# Altium project 全兼容主控.PrjPCB
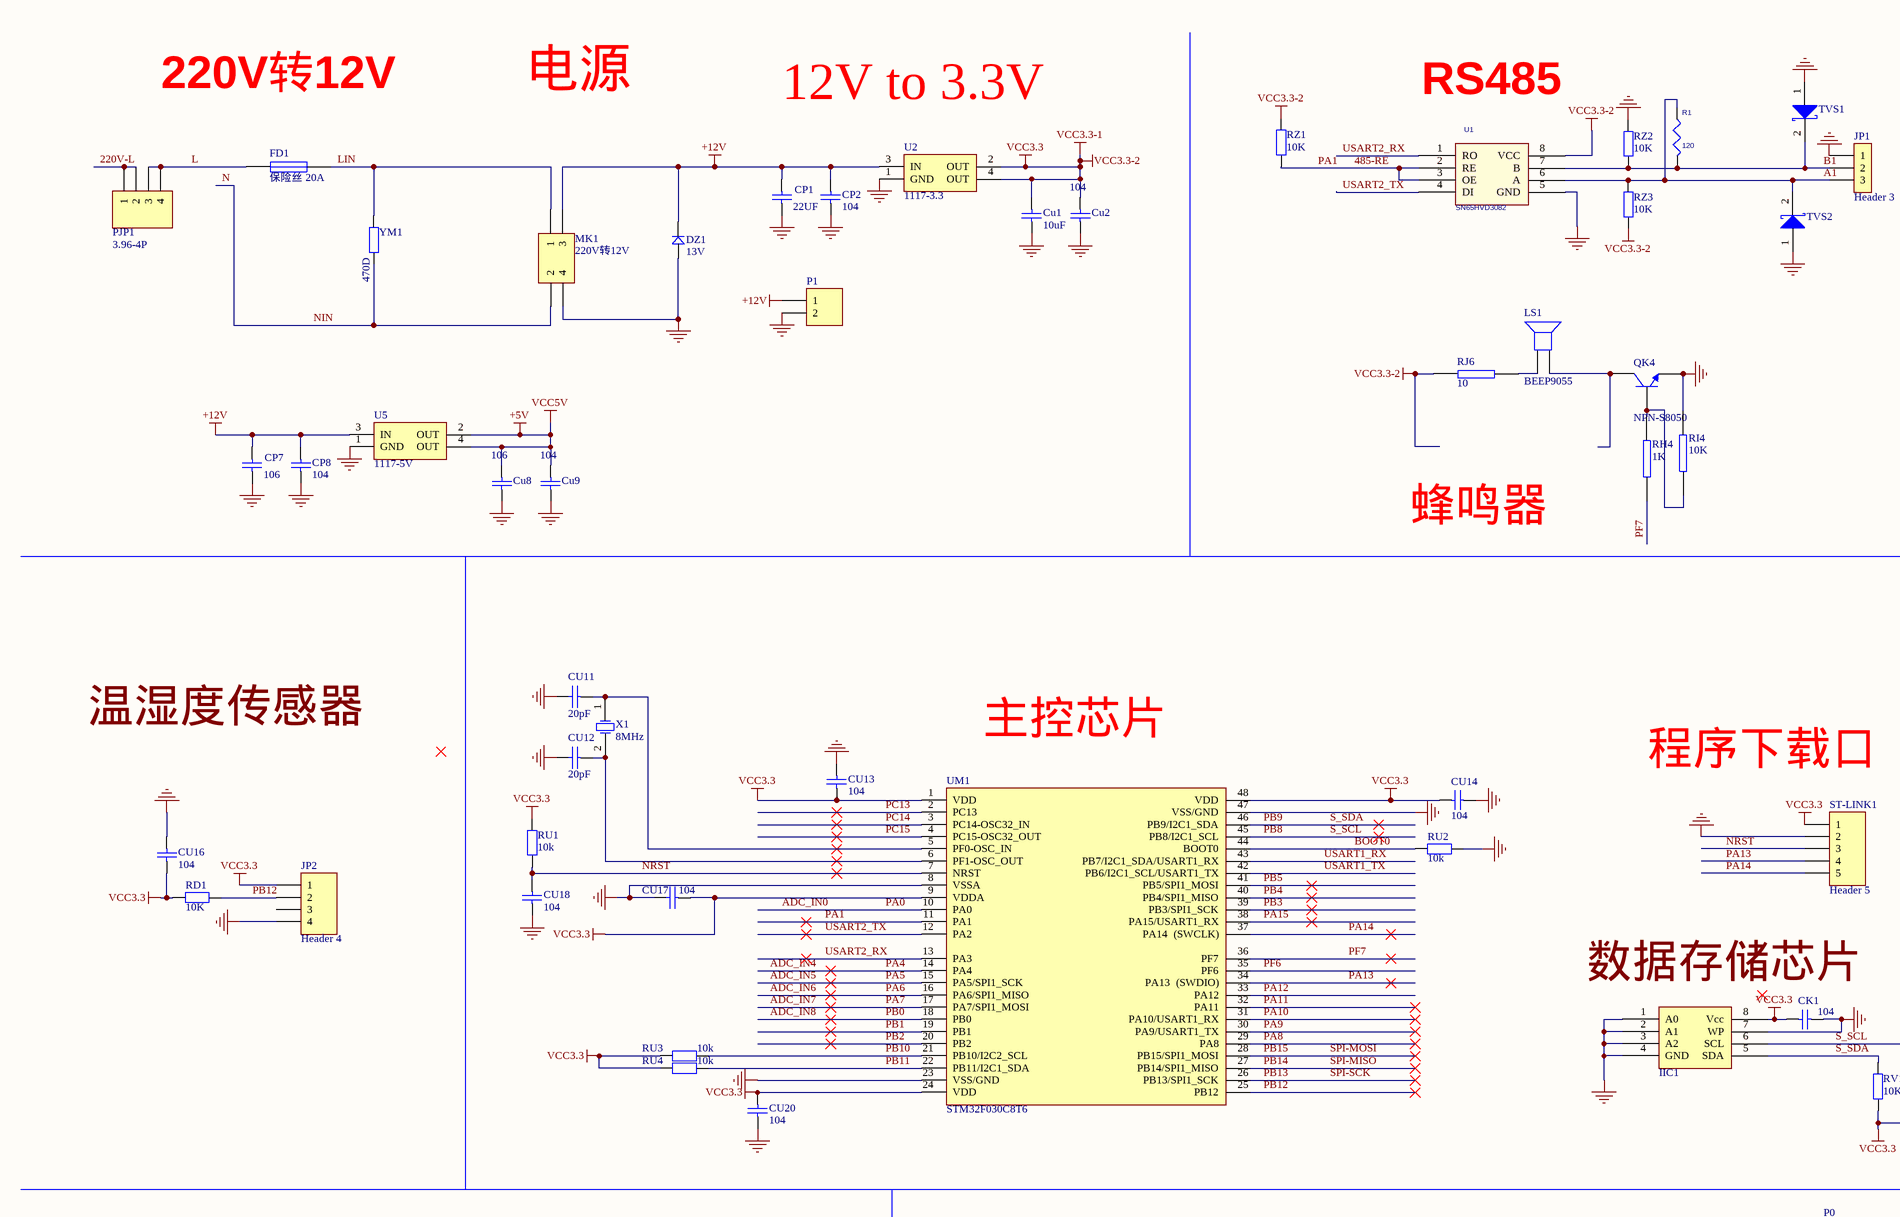
[diagram p0: 全兼容主控.SchDoc, top left]
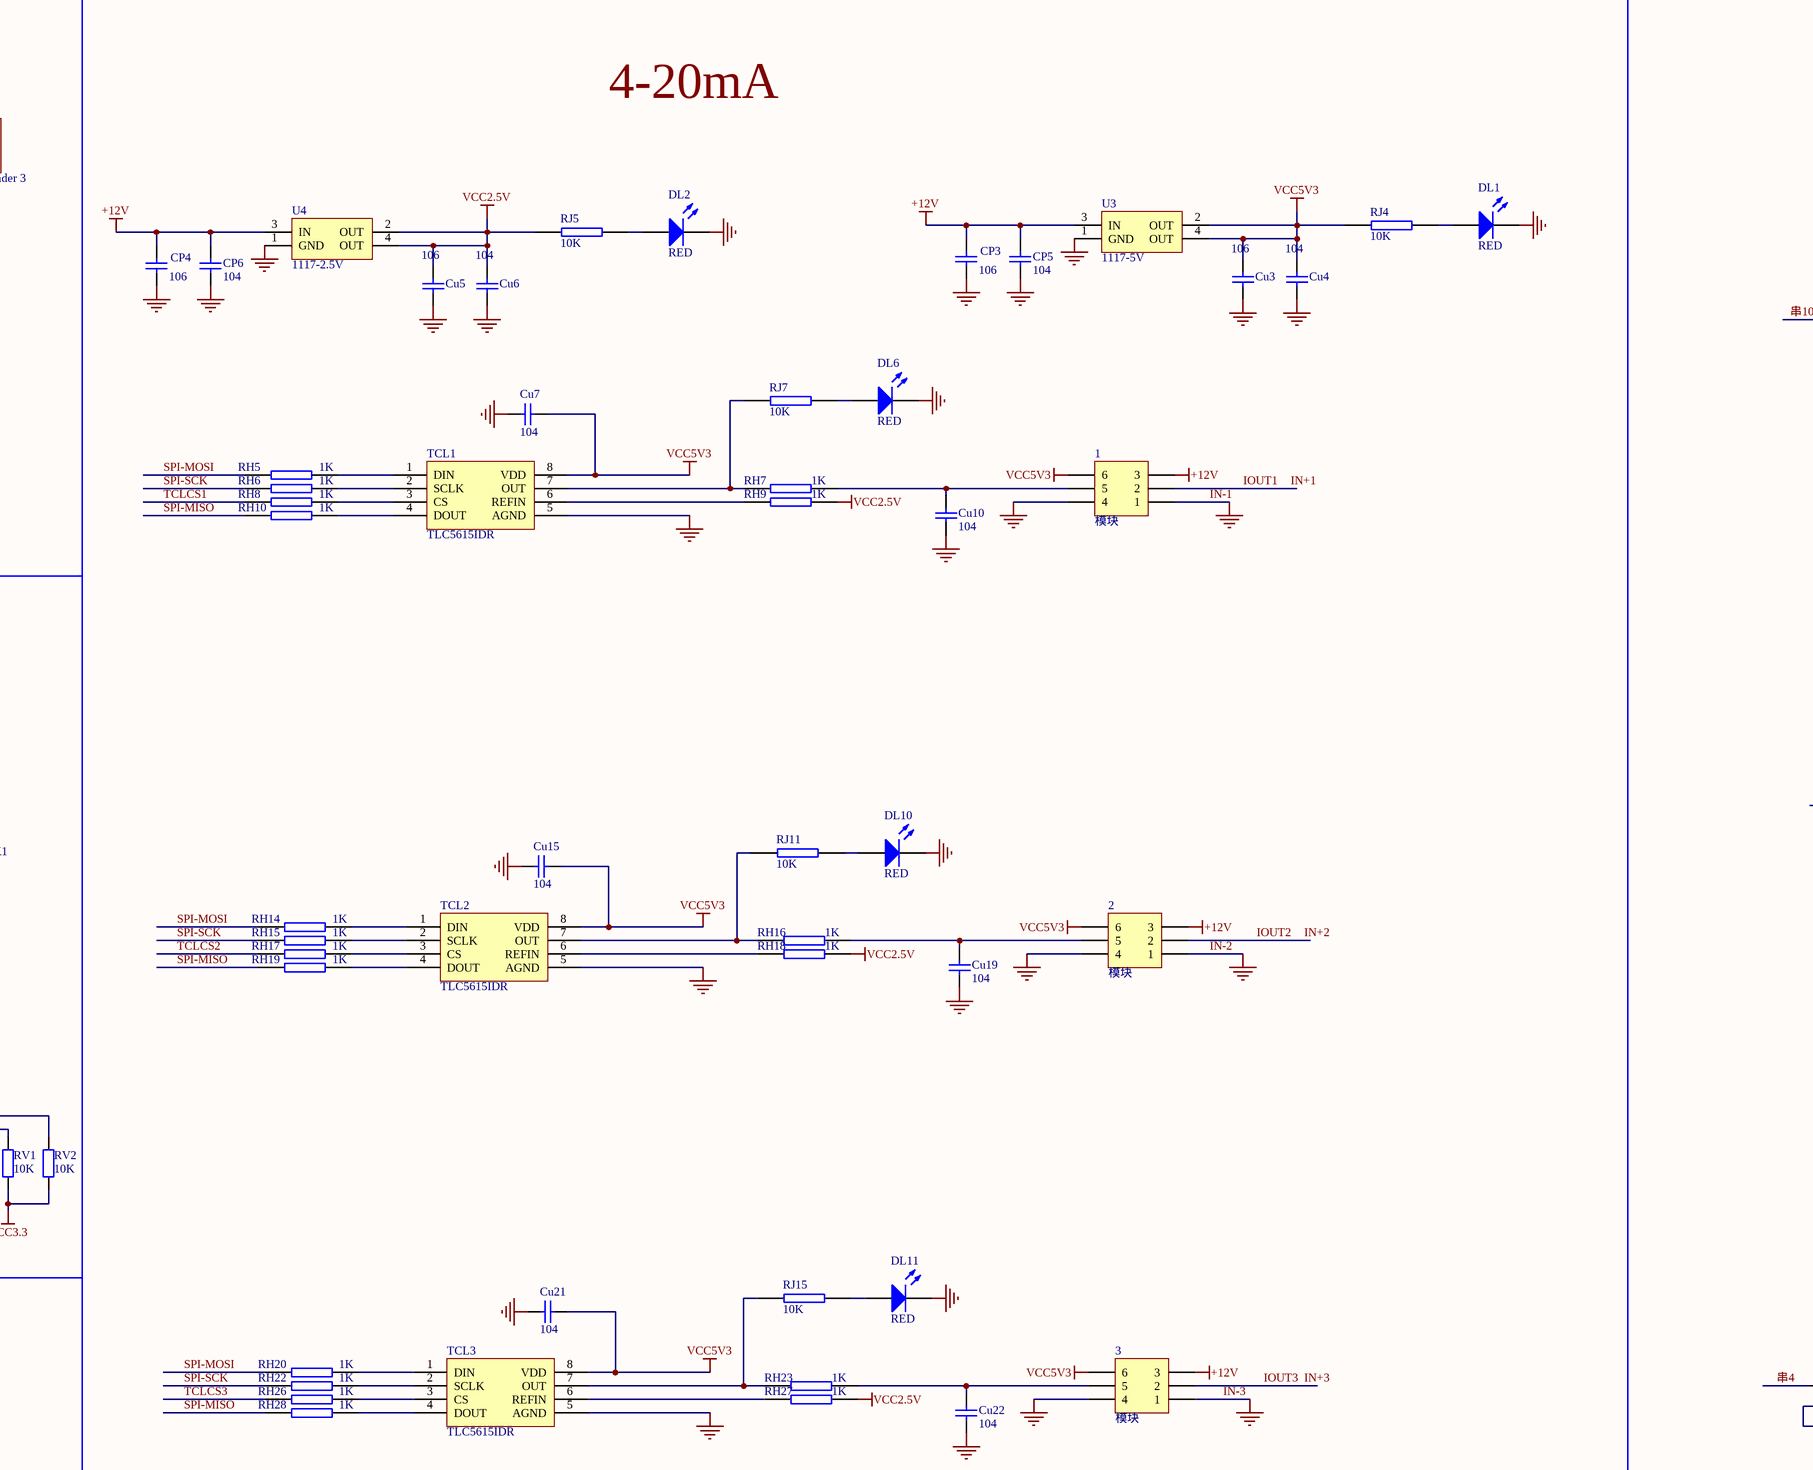
[diagram p1: 全兼容主控.SchDoc, top middle]
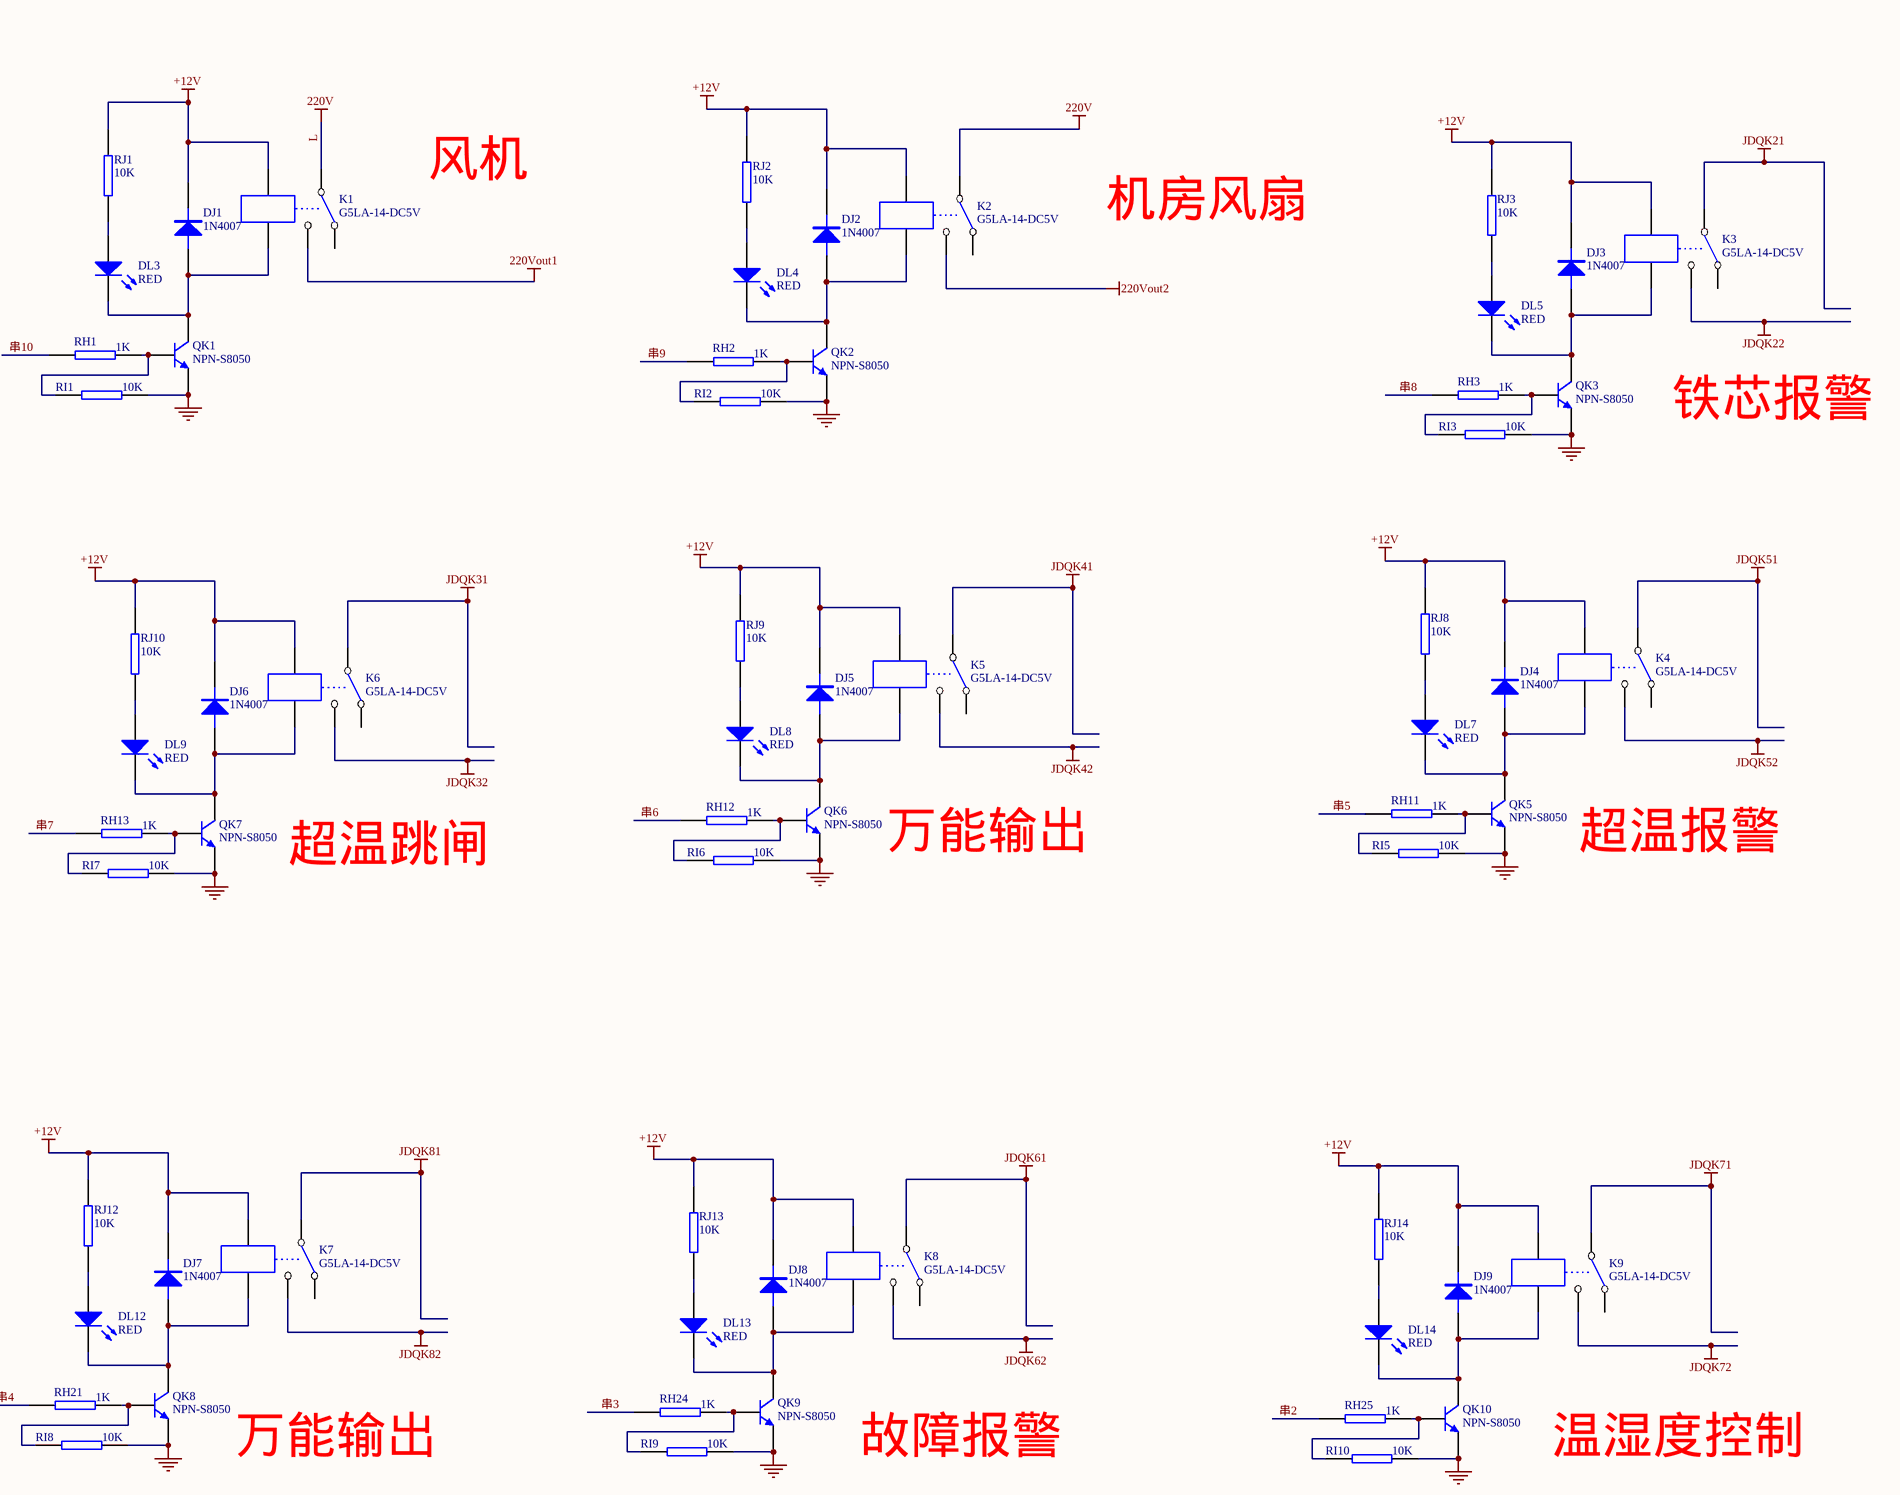
[diagram p2: 全兼容主控.SchDoc, top right]
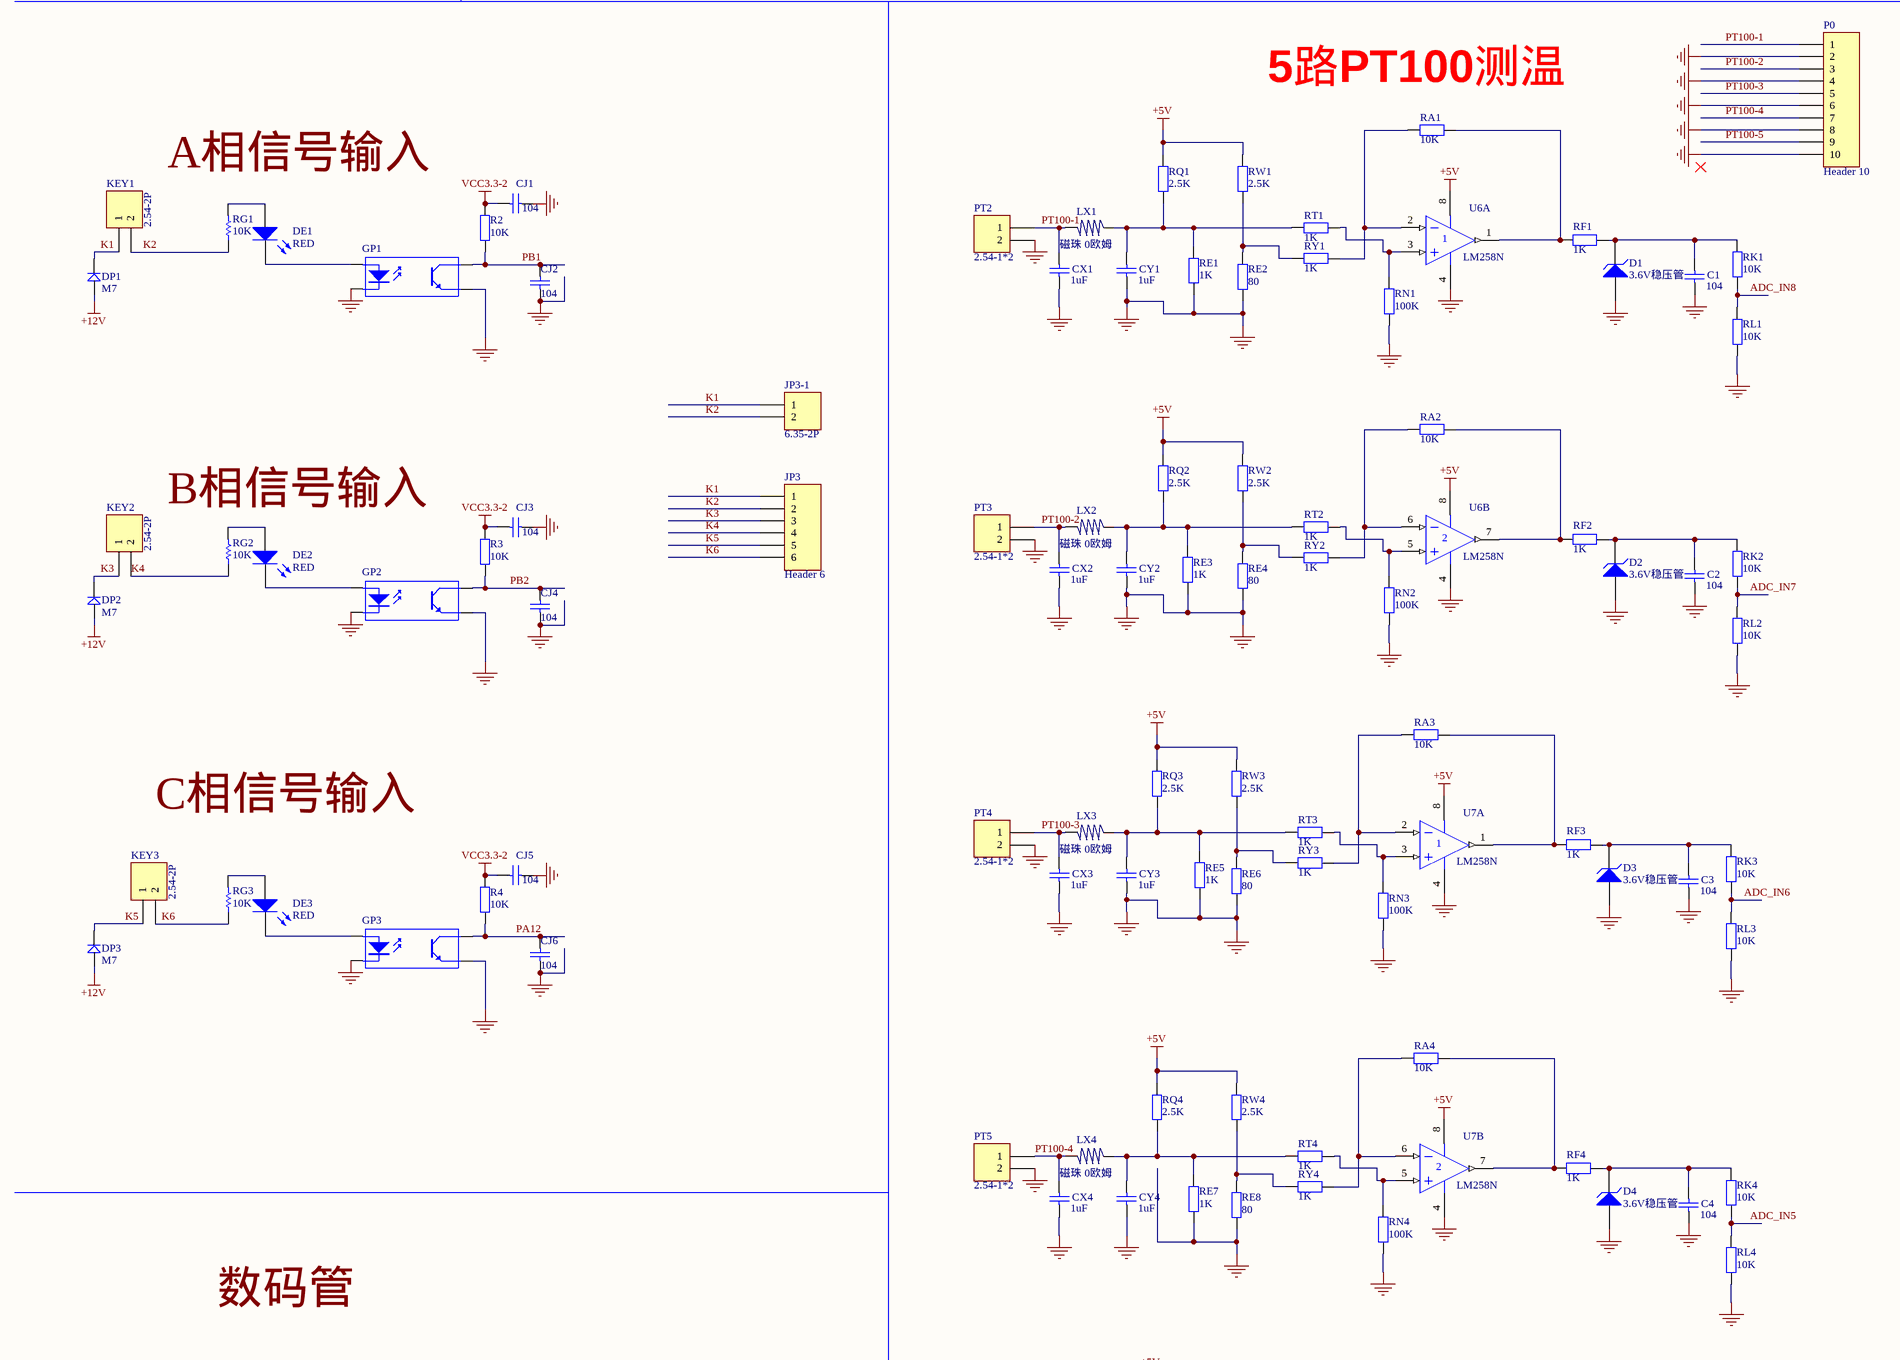
[diagram p3: 全兼容主控.SchDoc, centre left]
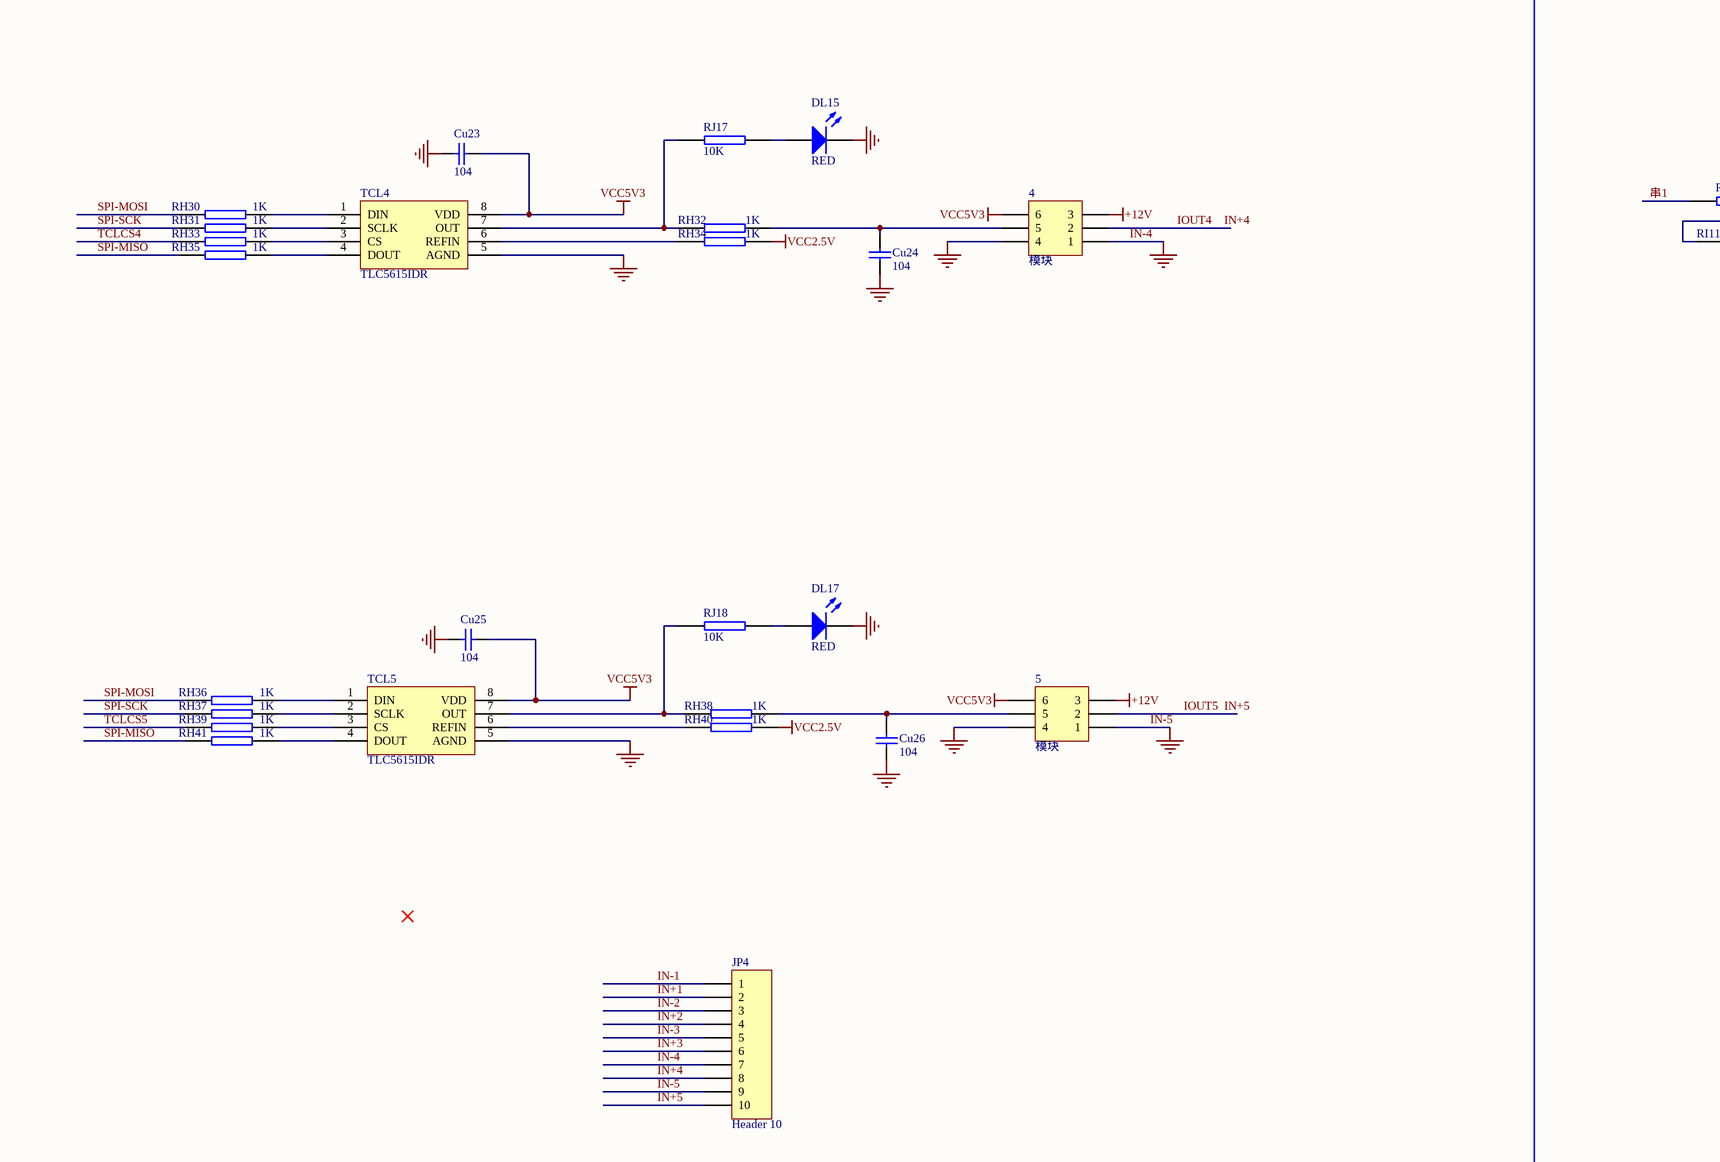
[diagram p4: 全兼容主控.SchDoc, centre middle]
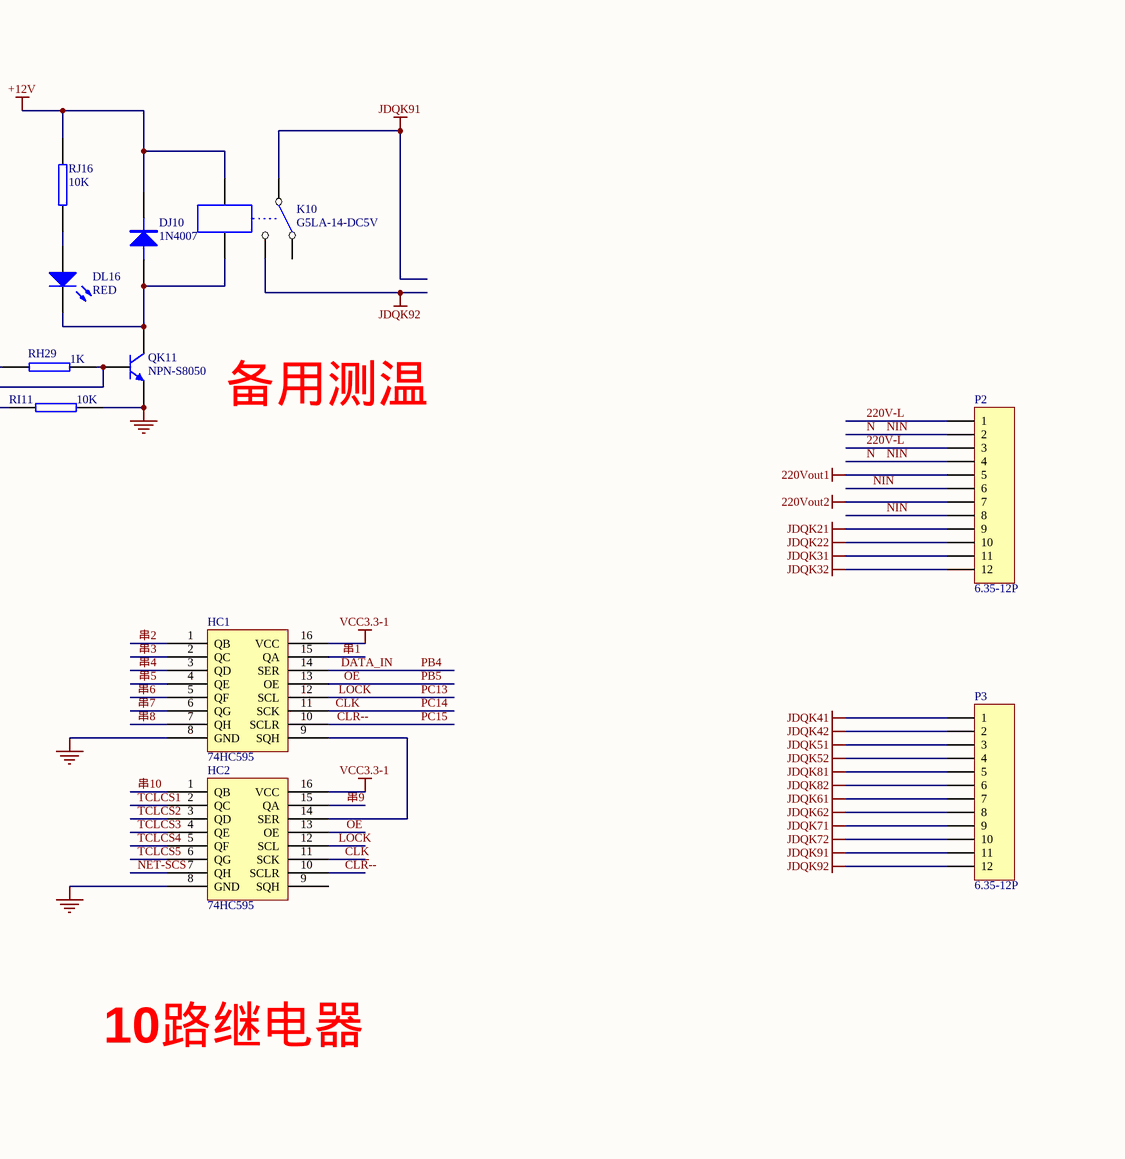
[diagram p5: 全兼容主控.SchDoc, centre right]
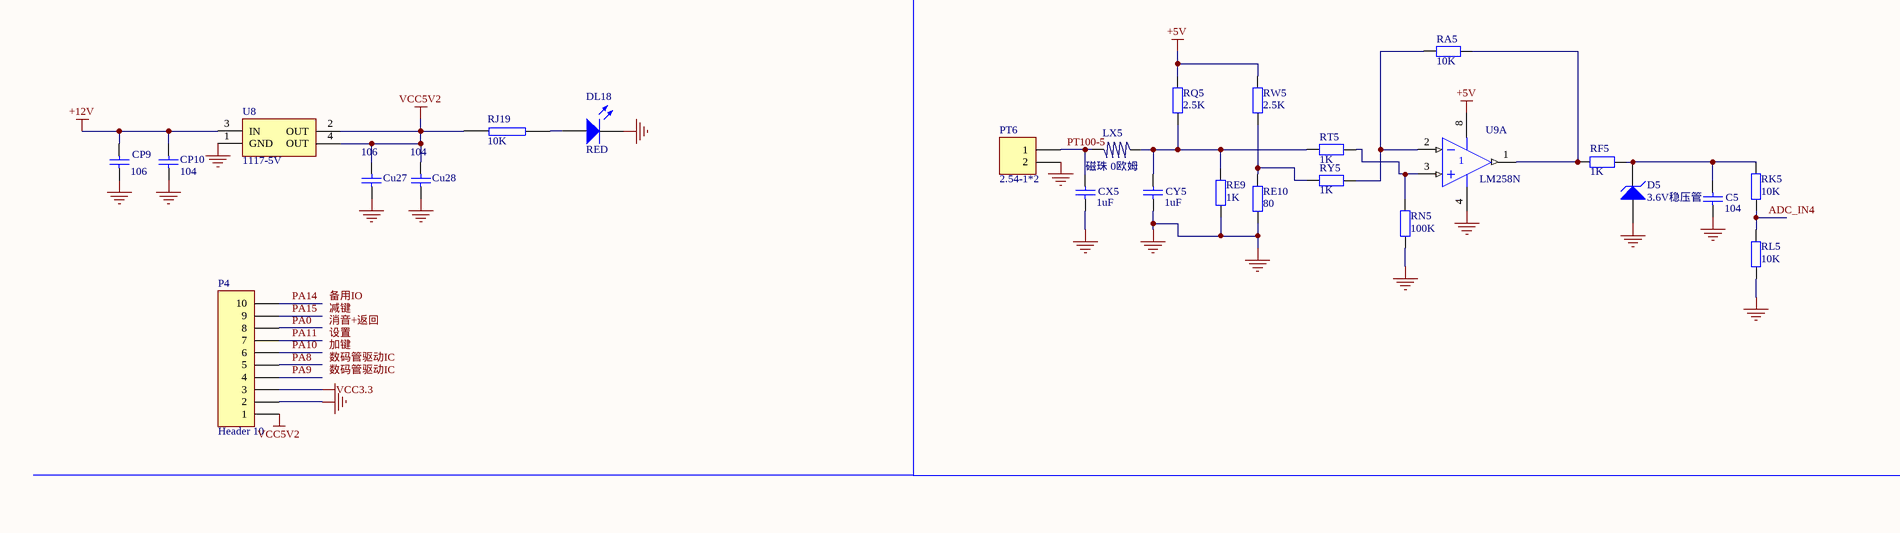
[diagram p6: 全兼容主控.SchDoc, bottom left]
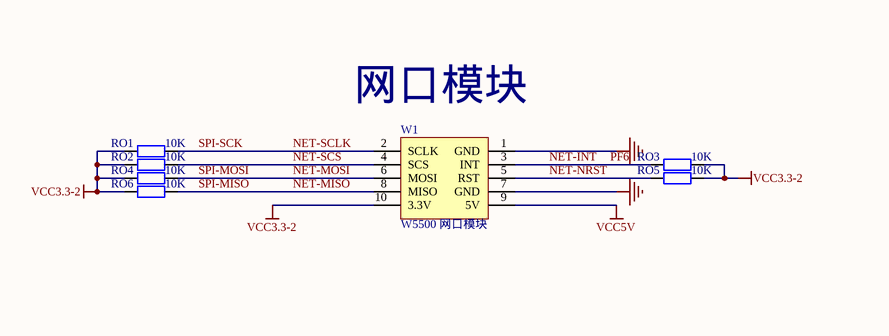
[diagram p7: 全兼容主控.SchDoc, bottom middle]
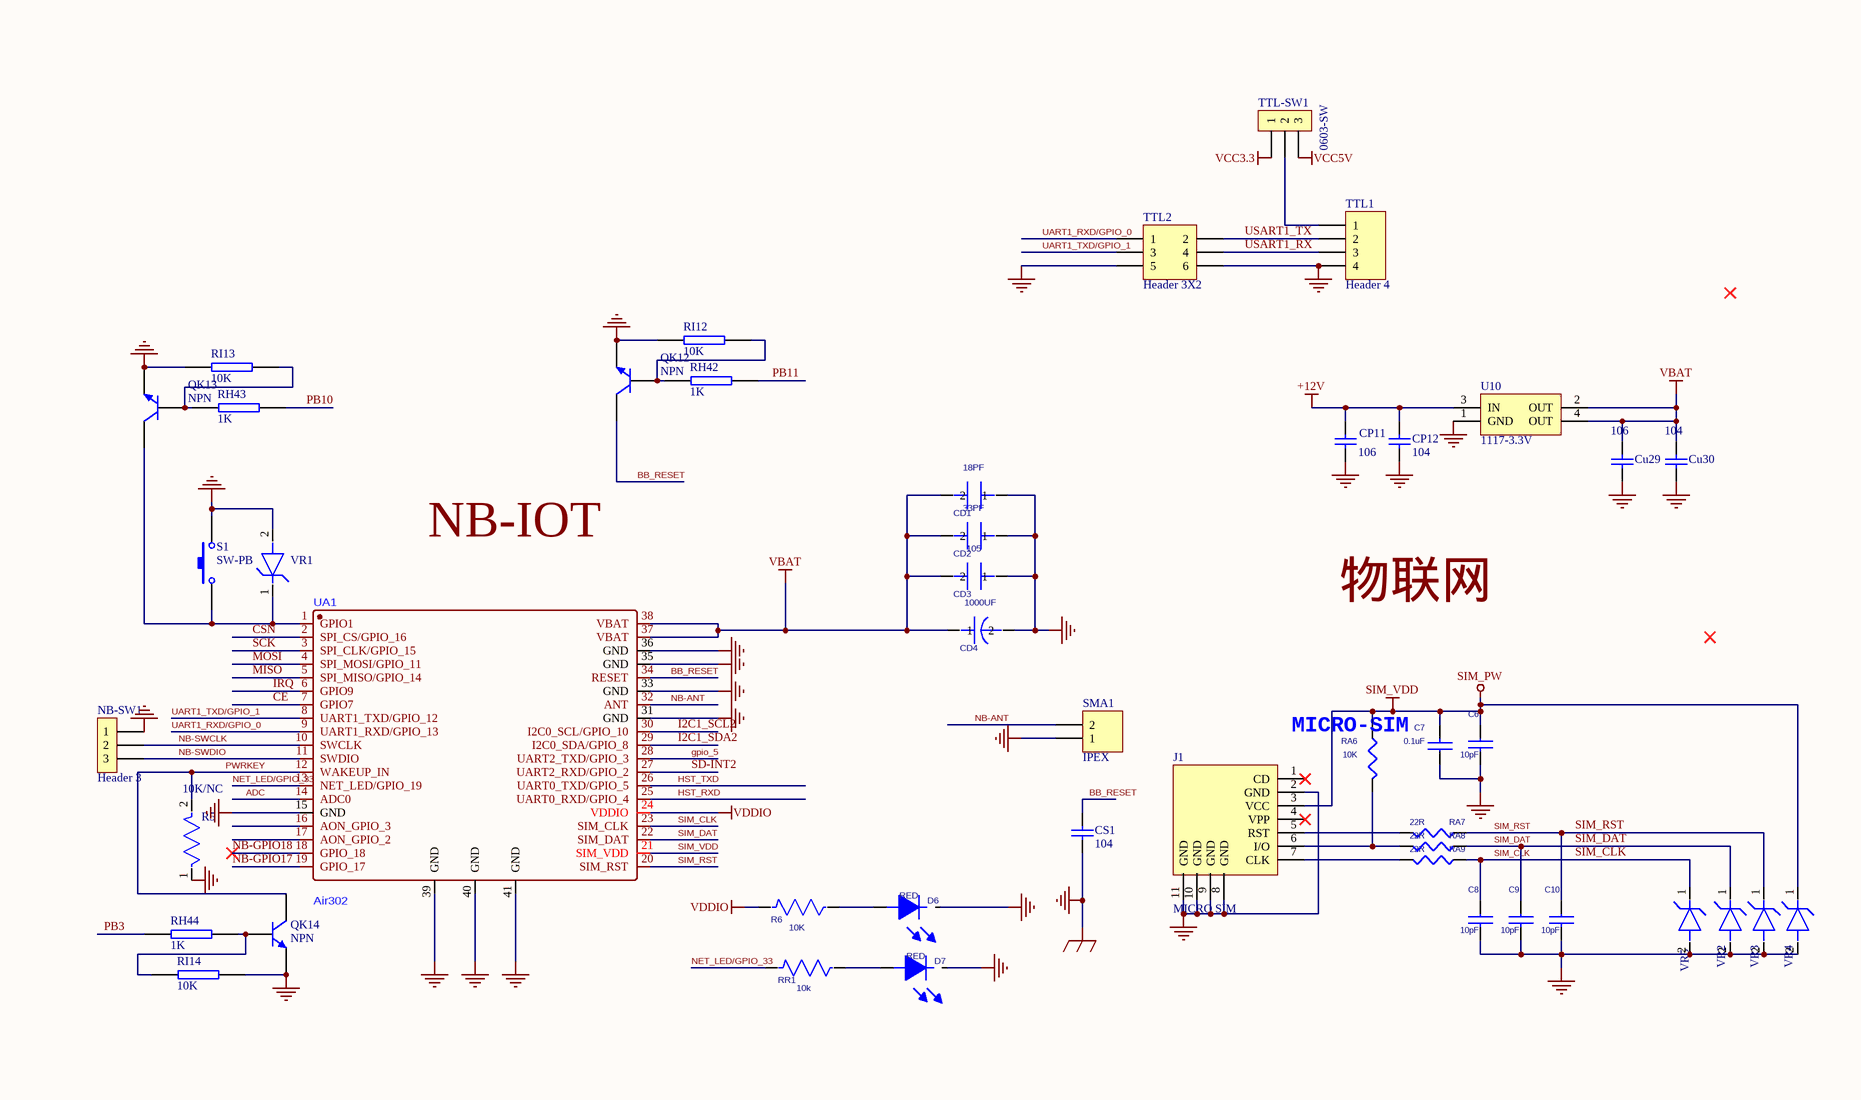
[diagram p8: 全兼容主控.SchDoc, bottom right]
1 sheet, 375 parts. Net scope: global (net labels, ports and power ports of the same name join across sheets).
Board file: 全兼容主控.PCBDOC

## Sheet 全兼容主控.SchDoc
size A0

### Parts
1  模块  [0-5V转4-20mA]
2  模块  [0-5V转4-20mA]
3  模块  [0-5V转4-20mA]
4  模块  [0-5V转4-20mA]
5  模块  [0-5V转4-20mA]
C1  104  [0603-1]
C2  104  [0603-1]
C3  104  [0603-1]
C4  104  [0603-1]
C5  104  [0603-1]
C6  10pF  [0603-1]
C7  0.1uF  [0603-1]
C8  10pF  [0603-1]
C9  10pF  [0603-1]
C10  10pF  [0603-1]
CD1  18PF  [0603-1]
CD2  33PF  [0603-1]
CD3  105  [0603-1]
CD4  1000UF  [贴片电容-1000UF-10.4X10.4]
CJ1  104  [0603-1]
CJ2  104  [0603-1]
CJ3  104  [0603-1]
CJ4  104  [0603-1]
CJ5  104  [0603-1]
CJ6  104  [0603-1]
CK1  104  [0603-1]
CP1  22UF  [0805]
CP2  104  [0603-1]
CP3  106  [0805]
CP4  106  [0805]
CP5  104  [0603-1]
CP6  104  [0603-1]
CP7  106  [0805]
CP8  104  [0603-1]
CP9  106  [0805]
CP10  104  [0603-1]
CP11  106  [0805]
CP12  104  [0603-1]
CS1  104  [0603-1]
Cu1  value 10uF  [0805]  (hidden comment: 106)
Cu2  104  [0603-1]
Cu3  106  [0805]
Cu4  104  [0603-1]
Cu5  106  [0805]
Cu6  104  [0603-1]
Cu7  104  [0603-1]
Cu8  106  [0805]
Cu9  104  [0603-1]
Cu10  104  [0603-1]
CU11  20pF  [0603-1]
CU12  20pF  [0603-1]
CU13  104  [0603-1]
CU14  104  [0603-1]
Cu15  104  [0603-1]
CU16  104  [0603-1]
CU17  104  [0603-1]
CU18  104  [0603-1]
Cu19  104  [0603-1]
CU20  104  [0603-1]
Cu21  104  [0603-1]
Cu22  104  [0603-1]
Cu23  104  [0603-1]
Cu24  104  [0603-1]
Cu25  104  [0603-1]
Cu26  104  [0603-1]
Cu27  106  [0805]
Cu28  104  [0603-1]
Cu29  106  [0805]
Cu30  104  [0603-1]
CX1  1uF  [1206]
CX2  1uF  [1206]
CX3  1uF  [1206]
CX4  1uF  [1206]
CX5  1uF  [1206]
CY1  1uF  [1206]
CY2  1uF  [1206]
CY3  1uF  [1206]
CY4  1uF  [1206]
CY5  1uF  [1206]
D1  3.6V稳压管  [DIODE]
D2  3.6V稳压管  [DIODE]
D3  3.6V稳压管  [DIODE]
D4  3.6V稳压管  [DIODE]
D5  3.6V稳压管  [DIODE]
D6  RED  [0603 - LED]
D7  RED  [0603 - LED]
DE1  RED  [0603 - LED]
DE2  RED  [0603 - LED]
DE3  RED  [0603 - LED]
DJ1  1N4007  [DIODE]
DJ2  1N4007  [DIODE]
DJ3  1N4007  [DIODE]
DJ4  1N4007  [DIODE]
DJ5  1N4007  [DIODE]
DJ6  1N4007  [DIODE]
DJ7  1N4007  [DIODE]
DJ8  1N4007  [DIODE]
DJ9  1N4007  [DIODE]
DJ10  1N4007  [DIODE]
DL1  RED  [0603 - LED]
DL2  RED  [0603 - LED]
DL3  RED  [0603 - LED]
DL4  RED  [0603 - LED]
DL5  RED  [0603 - LED]
DL6  RED  [0603 - LED]
DL7  RED  [0603 - LED]
DL8  RED  [0603 - LED]
DL9  RED  [0603 - LED]
DL10  RED  [0603 - LED]
DL11  RED  [0603 - LED]
DL12  RED  [0603 - LED]
DL13  RED  [0603 - LED]
DL14  RED  [0603 - LED]
DL15  RED  [0603 - LED]
DL16  RED  [0603 - LED]
DL17  RED  [0603 - LED]
DL18  RED  [0603 - LED]
DP1  M7  [DIODE]
DP2  M7  [DIODE]
DP3  M7  [DIODE]
DZ1  13V  [DIODE]
FD1  保险丝 20A  [1808]
GP1  guangou*1  [PC817 SMD-4P]  (value not drawn)
GP2  guangou*1  [PC817 SMD-4P]  (value not drawn)
GP3  guangou*1  [PC817 SMD-4P]  (value not drawn)
HC1  74HC595  [SOP-16]
HC2  74HC595  [SOP-16]
IIC1  24c64  [SOP-8P]  (value not drawn)
J1  MICRO SIM  [Nano-SIM卡 自弹式]
JP1  Header 3  [HDR1X3]
JP2  Header 4  [HDR1X4]
JP3  Header 6  [HDR1X6]
JP3-1  6.35-2P  [6.35-2P]
JP4  Header 10  [HDR1X10]
K1  G5LA-14-DC5V  [继电器 松乐SRD-12VDC-SL-C]
K2  G5LA-14-DC5V  [继电器 松乐SRD-12VDC-SL-C]
K3  G5LA-14-DC5V  [继电器 松乐SRD-12VDC-SL-C]
K4  G5LA-14-DC5V  [继电器 松乐SRD-12VDC-SL-C]
K5  G5LA-14-DC5V  [继电器 松乐SRD-12VDC-SL-C]
K6  G5LA-14-DC5V  [继电器 松乐SRD-12VDC-SL-C]
K7  G5LA-14-DC5V  [继电器 松乐SRD-12VDC-SL-C]
K8  G5LA-14-DC5V  [继电器 松乐SRD-12VDC-SL-C]
K9  G5LA-14-DC5V  [继电器 松乐SRD-12VDC-SL-C]
K10  G5LA-14-DC5V  [继电器 松乐SRD-12VDC-SL-C]
KEY1  2.54-2P  [HDR1X2]
KEY2  2.54-2P  [HDR1X2]
KEY3  2.54-2P  [HDR1X2]
LS1  BEEP9055  [BEEP9055]
LX1  磁珠 0欧姆  [1206]
LX2  磁珠 0欧姆  [1206]
LX3  磁珠 0欧姆  [1206]
LX4  磁珠 0欧姆  [1206]
LX5  磁珠 0欧姆  [1206]
MK1  220V转12V  [220V转5V 2A]
NB-SW1  Header 3  [HDR1X3]
P0  Header 10  [HDR1X10]
P1  (no value)  [HDR1X2]
P2  6.35-12P  [6.35-12P]
P3  6.35-12P  [6.35-12P]
P4  Header 10  [HDR1X10]
PJP1  3.96-4P  [3.96-4P]
PT2  2.54-1*2  [HDR1X2]
PT3  2.54-1*2  [HDR1X2]
PT4  2.54-1*2  [HDR1X2]
PT5  2.54-1*2  [HDR1X2]
PT6  2.54-1*2  [HDR1X2]
QK1  NPN-S8050  [NPN-SOT3]
QK2  NPN-S8050  [NPN-SOT3]
QK3  NPN-S8050  [NPN-SOT3]
QK4  NPN-S8050  [NPN-SOT3]
QK5  NPN-S8050  [NPN-SOT3]
QK6  NPN-S8050  [NPN-SOT3]
QK7  NPN-S8050  [NPN-SOT3]
QK8  NPN-S8050  [NPN-SOT3]
QK9  NPN-S8050  [NPN-SOT3]
QK10  NPN-S8050  [NPN-SOT3]
QK11  NPN-S8050  [NPN-SOT3]
QK12  NPN  [NPN-SOT3]
QK13  NPN  [NPN-SOT3]
QK14  NPN  [NPN-SOT3]
R1  120  [0603-1]
R2  10K  [0603-1]
R3  10K  [0603-1]
R4  10K  [0603-1]
R5  10K/NC  [0603-1]
R6  10K  [0603-1]
RA1  10K  [0603-1]
RA2  10K  [0603-1]
RA3  10K  [0603-1]
RA4  10K  [0603-1]
RA5  10K  [0603-1]
RA6  10K  [0603-1]
RA7  22R  [0603-1]
RA8  22R  [0603-1]
RA9  22R  [0603-1]
RD1  10K  [0603-1]
RE1  1K  [0603-1]
RE2  80  [0603-1]
RE3  1K  [0603-1]
RE4  80  [0603-1]
RE5  1K  [0603-1]
RE6  80  [0603-1]
RE7  1K  [0603-1]
RE8  80  [0603-1]
RE9  1K  [0603-1]
RE10  80  [0603-1]
RF1  1K  [0603-1]
RF2  1K  [0603-1]
RF3  1K  [0603-1]
RF4  1K  [0603-1]
RF5  1K  [0603-1]
RG1  10K  [0603-1]
RG2  10K  [0603-1]
RG3  10K  [0603-1]
RH1  1K  [0603-1]
RH2  1K  [0603-1]
RH3  1K  [0603-1]
RH4  1K  [0603-1]
RH5  1K  [0603-1]
RH6  1K  [0603-1]
RH7  1K  [0603-1]
RH8  1K  [0603-1]
RH9  1K  [0603-1]
RH10  1K  [0603-1]
RH11  1K  [0603-1]
RH12  1K  [0603-1]
RH13  1K  [0603-1]
RH14  1K  [0603-1]
RH15  1K  [0603-1]
RH16  1K  [0603-1]
RH17  1K  [0603-1]
RH18  1K  [0603-1]
RH19  1K  [0603-1]
RH20  1K  [0603-1]
RH21  1K  [0603-1]
RH22  1K  [0603-1]
RH23  1K  [0603-1]
RH24  1K  [0603-1]
RH25  1K  [0603-1]
RH26  1K  [0603-1]
RH27  1K  [0603-1]
RH28  1K  [0603-1]
RH29  1K  [0603-1]
RH30  1K  [0603-1]
RH31  1K  [0603-1]
RH32  1K  [0603-1]
RH33  1K  [0603-1]
RH34  1K  [0603-1]
RH35  1K  [0603-1]
RH36  1K  [0603-1]
RH37  1K  [0603-1]
RH38  1K  [0603-1]
RH39  1K  [0603-1]
RH40  1K  [0603-1]
RH41  1K  [0603-1]
RH42  1K  [0603-1]
RH43  1K  [0603-1]
RH44  1K  [0603-1]
RI1  10K  [0603-1]
RI2  10K  [0603-1]
RI3  10K  [0603-1]
RI4  10K  [0603-1]
RI5  10K  [0603-1]
RI6  10K  [0603-1]
RI7  10K  [0603-1]
RI8  10K  [0603-1]
RI9  10K  [0603-1]
RI10  10K  [0603-1]
RI11  10K  [0603-1]
RI12  10K  [0603-1]
RI13  10K  [0603-1]
RI14  10K  [0603-1]
RJ1  10K  [0603-1]
RJ2  10K  [0603-1]
RJ3  10K  [0603-1]
RJ4  10K  [0603-1]
RJ5  10K  [0603-1]
RJ6  10  [0603-1]
RJ7  10K  [0603-1]
RJ8  10K  [0603-1]
RJ9  10K  [0603-1]
RJ10  10K  [0603-1]
RJ11  10K  [0603-1]
RJ12  10K  [0603-1]
RJ13  10K  [0603-1]
RJ14  10K  [0603-1]
RJ15  10K  [0603-1]
RJ16  10K  [0603-1]
RJ17  10K  [0603-1]
RJ18  10K  [0603-1]
RJ19  10K  [0603-1]
RK1  10K  [0603-1]
RK2  10K  [0603-1]
RK3  10K  [0603-1]
RK4  10K  [0603-1]
RK5  10K  [0603-1]
RL1  10K  [0603-1]
RL2  10K  [0603-1]
RL3  10K  [0603-1]
RL4  10K  [0603-1]
RL5  10K  [0603-1]
RN1  100K  [0603-1]
RN2  100K  [0603-1]
RN3  100K  [0603-1]
RN4  100K  [0603-1]
RN5  100K  [0603-1]
RO1  10K  [0603-1]
RO2  10K  [0603-1]
RO3  10K  [0603-1]
RO4  10K  [0603-1]
RO5  10K  [0603-1]
RO6  10K  [0603-1]
RQ1  2.5K  [0603-1]
RQ2  2.5K  [0603-1]
RQ3  2.5K  [0603-1]
RQ4  2.5K  [0603-1]
RQ5  2.5K  [0603-1]
RR1  10k  [0603-1]
RT1  1K  [0603-1]
RT2  1K  [0603-1]
RT3  1K  [0603-1]
RT4  1K  [0603-1]
RT5  1K  [0603-1]
RU1  10k  [0603-1]
RU2  10k  [0603-1]
RU3  10k  [0603-1]
RU4  10k  [0603-1]
RV1  10K  [0603-1]
RV2  10K  [0603-1]
RW1  2.5K  [0603-1]
RW2  2.5K  [0603-1]
RW3  2.5K  [0603-1]
RW4  2.5K  [0603-1]
RW5  2.5K  [0603-1]
RY1  1K  [0603-1]
RY2  1K  [0603-1]
RY3  1K  [0603-1]
RY4  1K  [0603-1]
RY5  1K  [0603-1]
RZ1  10K  [0603-1]
RZ2  10K  [0603-1]
RZ3  10K  [0603-1]
S1  SW-PB  [SW_2 - SMT]
SMA1  IPEX  [IPEX 接头]
ST-LINK1  Header 5  [HDR1X5]
TCL1  TLC5615IDR  [SOP-8]
TCL2  TLC5615IDR  [SOP-8]
TCL3  TLC5615IDR  [SOP-8]
TCL4  TLC5615IDR  [SOP-8]
TCL5  TLC5615IDR  [SOP-8]
TTL1  Header 4  [HDR1X4]
TTL2  Header 3X2  [HDR2X3]
TTL-SW1  0603-SW  [HDR1X3]
TVS1  (no value)  [DIODE]
TVS2  (no value)  [DIODE]
U1  SN65HVD3082  [SOP-8P]
U2  1117-3.3  [SOT223]
U3  1117-5V  [SOT223]
U4  1117-2.5V  [SOT223]
U5  1117-5V  [SOT223]
U6  LM258N  [SOP-8]  (parts A,B of 2)
U7  LM258N  [SOP-8]  (parts A,B of 2)
U8  1117-5V  [SOT223]
U9  LM258N  [SOP-8]  (part A of 2)
U10  1117-3.3V  [SOT223]
UA1  Air302  [AIR202]
UM1  STM32F030C8T6  [LQFP48]
VR1  ESD-TVS-UM5079  [0603-1]  (value not drawn)
VR2  ESD-TVS-UM5079  [0603-1]  (value not drawn)
VR3  ESD-TVS-UM5079  [0603-1]  (value not drawn)
VR4  ESD-TVS-UM5079  [0603-1]  (value not drawn)
VR5  ESD-TVS-UM5079  [0603-1]  (value not drawn)
W1  W5500 网口模块  [W5500 网口模块]
X1  8MHz  [5032]
YM1  470D  [压敏电阻]

### Nets
220Vout1: K1.3 P2.5
220Vout2: K2.3 P2.7
+5V: Cu8.1 Cu9.2 RQ1.2 RQ2.2 RQ3.2 RQ4.2 RQ5.2 RW1.2 RW2.2 RW3.2 RW4.2 RW5.2 TTL-SW1.3 U5.2(OUT) U5.4(OUT) U6.8(V+) U7.8(V+) U9.8(V+) W1.9(5V)  [also labelled VCC5V]
+12V: 1.3 2.3 3.3 4.3 5.3 CP1.1 CP2.2 CP3.1 CP4.1 CP5.2 CP6.2 CP7.1 CP8.2 CP9.1 CP10.2 CP11.1 CP12.2 DJ1.2(K) DJ2.2(K) DJ3.2(K) DJ4.2(K) DJ5.2(K) DJ6.2(K) DJ7.2(K) DJ8.2(K) DJ9.2(K) DJ10.2(K) DP1.1 DP2.1 DP3.1 DZ1.2 K1.4 K2.4 K3.4 K4.4 K5.4 K6.4 K7.4 K8.4 K9.4 K10.4 MK1.3 P1.1 RJ1.1 RJ2.1 RJ3.1 RJ8.1 RJ9.1 RJ10.1 RJ12.1 RJ13.1 RJ14.1 RJ16.1 U2.3(IN) U3.3(IN) U4.3(IN) U5.3(IN) U8.3(IN) U10.3(IN)
IN-1: 1.1 1.4 2.1 2.4 3.1 3.4 4.1 4.4 5.1 5.4 C1.1 C2.1 C3.1 C4.1 C5.1 C6.2 C7.1 C8.2 C9.2 C10.2 CD1.1 CD2.1 CD3.1 CD4.2 CJ1.2 CJ2.1 CJ3.2 CJ4.1 CJ5.2 CJ6.1 CK1.1 CP1.2 CP2.1 CP3.2 CP4.2 CP5.1 CP6.1 CP7.2 CP8.1 CP9.2 CP10.1 CP11.2 CP12.1 CS1.2 Cu1.2 Cu2.1 Cu3.2 Cu4.1 Cu5.2 Cu6.1 Cu7.2 Cu8.2 Cu9.1 Cu10.2 CU11.2 CU12.2 CU13.2 CU14.2 Cu15.2 CU16.2 CU17.2 CU18.2 Cu19.2 CU20.2 Cu21.2 Cu22.2 Cu23.2 Cu24.2 Cu25.2 Cu26.2 Cu27.2 Cu28.1 Cu29.2 Cu30.1 CX1.1 CX2.1 CX3.1 CX4.1 CX5.1 CY1.1 CY2.1 CY3.1 CY4.1 CY5.1 D1.1(A) D2.1(A) D3.1(A) D4.1(A) D5.1(A) D6.2 D7.2 DL1.2(K) DL2.2(K) DL6.2(K) DL10.2(K) DL11.2(K) DL15.2(K) DL17.2(K) DL18.2(K) DZ1.1 GP1.2(K) GP1.3(E) GP2.2(K) GP2.3(E) GP3.2(K) GP3.3(E) HC1.8(GND) HC2.8(GND) IIC1.1(A0) IIC1.2(A1) IIC1.3(A2) IIC1.4(GND) IIC1.7(WP) J1.2(GND) J1.8(GND) J1.9(GND) J1.10(GND) J1.11(GND) JP1.1 JP2.4 JP4.1 JP4.3 JP4.5 JP4.7 JP4.9 MK1.4 NB-SW1.1 P0.2 P0.4 P0.6 P0.8 P0.10 P1.2 P4.2 PT2.2 PT3.2 PT4.2 PT5.2 PT6.2 QK1.3(E) QK2.3(E) QK3.3(E) QK4.3(E) QK5.3(E) QK6.3(E) QK7.3(E) QK8.3(E) QK9.3(E) QK10.3(E) QK11.3(E) QK12.3(E) QK13.3(E) QK14.3(E) R5.1 RE1.1 RE2.1 RE3.1 RE4.1 RE5.1 RE6.1 RE7.1 RE8.1 RE9.1 RE10.1 RI1.2 RI2.2 RI3.2 RI4.2 RI5.2 RI6.2 RI7.2 RI8.2 RI9.2 RI10.2 RI11.2 RI12.2 RI13.2 RI14.2 RL1.1 RL2.1 RL3.1 RL4.1 RL5.1 RN1.2 RN2.2 RN3.2 RN4.2 RN5.2 RU2.1 RZ2.1 S1.2 SMA1.1 ST-LINK1.2 TCL1.5(AGND) TCL2.5(AGND) TCL3.5(AGND) TCL4.5(AGND) TCL5.5(AGND) TTL1.4 TTL2.5 TTL2.6 TVS1.1(A) TVS2.1(A) U1.5(GND) U2.1(GND) U3.1(GND) U4.1(GND) U5.1(GND) U6.4(V-) U7.4(V-) U8.1(GND) U9.4(V-) U10.1(GND) UA1.15(GND) UA1.31(GND) UA1.33(GND) UA1.35(GND) UA1.36(GND) UA1.39(GND) UA1.40(GND) UA1.41(GND) UM1.8(VSSA) UM1.23(VSS/GND) UM1.47(VSS/GND) VR1.2 VR2.2 VR3.2 VR4.2 VR5.2 W1.1(GND) W1.7(GND)  [also labelled GND, IN-2, IN-3, IN-4, IN-5, SGND]
JDQK21: K3.1 P2.9
JDQK22: K3.3 P2.10
JDQK31: K6.1 P2.11
JDQK32: K6.3 P2.12
JDQK41: K5.1 P3.1
JDQK42: K5.3 P3.2
JDQK51: K4.1 P3.3
JDQK52: K4.3 P3.4
JDQK61: K8.1 P3.7
JDQK62: K8.3 P3.8
JDQK71: K9.1 P3.9
JDQK72: K9.3 P3.10
JDQK81: K7.1 P3.5
JDQK82: K7.3 P3.6
JDQK91: K10.1 P3.11
JDQK92: K10.3 P3.12
L: FD1.1 K1.1 K2.1 PJP1.3 PJP1.4  [also labelled 220V]
SIM_VDD: C6.1 C7.2 J1.3(VCC) RA6.2 UA1.21(SIM_VDD) VR4.1  [also labelled SIM_PW]
VBAT: CD1.2 CD2.2 CD3.2 CD4.1 Cu29.1 Cu30.2 U10.2(OUT) U10.4(OUT) UA1.37(VBAT) UA1.38(VBAT)
VCC2.5V: Cu5.1 Cu6.2 RH9.1 RH18.1 RH27.1 RH34.1 RH40.1 RJ5.1 U4.2(OUT) U4.4(OUT)
VCC3.3: CJ1.1 CJ3.1 CJ5.1 CK1.2 Cu1.1 Cu2.2 CU13.1 CU14.1 CU16.1 CU17.1 CU20.1 HC1.16(VCC) HC2.16(VCC) IIC1.8(Vcc) JP2.1 P4.3 R2.2 R3.2 R4.2 RD1.1 RJ6.1 RO1.2 RO2.2 RO3.1 RO4.2 RO5.1 RO6.2 RU1.1 RU3.1 RU4.1 RV1.2 RV2.2 RZ1.2 RZ3.2 ST-LINK1.1 TTL-SW1.1 U1.8(VCC) U2.2(OUT) U2.4(OUT) UM1.1(VDD) UM1.9(VDDA) UM1.24(VDD) UM1.48(VDD) W1.10(3.3V)  [also labelled VCC3.3-1, VCC3.3-2]
VCC5V2: Cu27.1 Cu28.2 P4.1 RJ19.1 U8.2(OUT) U8.4(OUT)
VCC5V3: 1.6 2.6 3.6 4.6 5.6 Cu3.1 Cu4.2 Cu7.1 Cu15.1 Cu21.1 Cu23.1 Cu25.1 RJ4.1 TCL1.8(VDD) TCL2.8(VDD) TCL3.8(VDD) TCL4.8(VDD) TCL5.8(VDD) U3.2(OUT) U3.4(OUT)
VDDIO: R6.2 UA1.24(VDDIO)
220V-L: P2.1 P2.3 PJP1.1 PJP1.2
485-RE: RZ1.1 U1.2(RE) U1.3(OE) UM1.11(PA1)  [also labelled PA1]
A1: JP1.3 R1.2 RZ3.1 TVS2.2(K) U1.6(A)
ADC: UA1.14(ADC0)
ADC_IN0: P4.8 UM1.10(PA0)  [also labelled PA0]
ADC_IN4: RK5.1 RL5.2 UM1.14(PA4)  [also labelled PA4]
ADC_IN5: RK4.1 RL4.2 UM1.15(PA5/SPI1_SCK)  [also labelled PA5]
ADC_IN6: RK3.1 RL3.2 UM1.16(PA6/SPI1_MISO)  [also labelled PA6]
ADC_IN7: RK2.1 RL2.2 UM1.17(PA7/SPI1_MOSI)  [also labelled PA7]
ADC_IN8: RK1.1 RL1.2 UM1.18(PB0)  [also labelled PB0]
B1: JP1.2 R1.1 RZ2.2 TVS1.2(K) U1.7(B)
BB_RESET: CS1.1 QK12.1(C) UA1.34(RESET)
BOOT0: RU2.2 UM1.44(BOOT0)
~{CLR}--: HC1.10(SCLR) HC2.10(SCLR) UM1.4(PC15-OSC32_OUT)  [also labelled PC15]
CE: UA1.7(GPIO7)
CLK: HC1.11(SCK) HC2.11(SCK) UM1.3(PC14-OSC32_IN)  [also labelled PC14]
CSN: UA1.2(SPI_CS/GPIO_16)
DATA_IN: HC1.14(SER) UM1.40(PB4/SPI1_MISO)  [also labelled PB4]
gpio_5: UA1.28(UART2_TXD/GPIO_3)
HST_RXD: UA1.25(UART0_RXD/GPIO_4)
HST_TXD: UA1.26(UART0_TXD/GPIO_5)
I2C1_SCL2: UA1.30(I2C0_SCL/GPIO_10)
I2C1_SDA2: UA1.29(I2C0_SDA/GPIO_8)
IN+1: 1.2 JP4.2  [also labelled IOUT1]
IN+2: 2.2 JP4.4  [also labelled IOUT2]
IN+3: 3.2 JP4.6  [also labelled IOUT3]
IN+4: 4.2 JP4.8  [also labelled IOUT4]
IN+5: 5.2 JP4.10  [also labelled IOUT5]
IRQ: UA1.6(GPIO9)
K1: DP1.2 JP3.1 JP3-1.1 KEY1.1
K2: JP3.2 JP3-1.2 KEY1.2 RG1.1
K3: DP2.2 JP3.3 KEY2.1
K4: JP3.4 KEY2.2 RG2.1
K5: DP3.2 JP3.5 KEY3.1
K6: JP3.6 KEY3.2 RG3.1
LIN: FD1.2 MK1.1 YM1.2
LOCK: HC1.12(SCL) HC2.12(SCL) UM1.2(PC13)  [also labelled PC13]
MISO: UA1.5(SPI_MISO/GPIO_14)
MOSI: UA1.4(SPI_MOSI/GPIO_11)
N: MK1.2 P2.2 P2.4 P2.6 P2.8 YM1.1  [also labelled NIN]
NB-ANT: SMA1.2 UA1.32(ANT)
NB-GPIO17: UA1.19(GPIO_17)
NB-GPIO18: UA1.18(GPIO_18)
NB-SWCLK: NB-SW1.2 UA1.10(SWCLK)
NB-SWDIO: NB-SW1.3 UA1.11(SWDIO)
NET-INT: RO3.2 UM1.35(PF6) W1.3(INT)  [also labelled PF6]
NET-MISO: RH10.1 RH19.1 RH28.1 RH35.1 RH41.1 RO6.1 UM1.27(PB14/SPI1_MISO) W1.8(MISO)  [also labelled PB14, SPI-MISO]
NET-MOSI: RH5.1 RH14.1 RH20.1 RH30.1 RH36.1 RO4.1 UM1.28(PB15/SPI1_MOSI) W1.6(MOSI)  [also labelled PB15, SPI-MOSI]
NET-NRST: RO5.2 W1.5(RST)
NET-SCLK: RH6.1 RH15.1 RH22.1 RH31.1 RH37.1 RO1.1 UM1.26(PB13/SPI1_SCK) W1.2(SCLK)  [also labelled PB13, SPI-SCK]
NET-SCS: HC2.7(QH) RO2.1 W1.4(SCS)
NET_LED/GPIO_33: RR1.2 UA1.13(NET_LED/GPIO_19)
NRST: CU18.1 RU1.2 ST-LINK1.3 UM1.7(NRST)
~{OE}: HC1.13(OE) HC2.13(OE) UM1.41(PB5/SPI1_MOSI)  [also labelled PB5]
PA8: P4.5 UM1.29(PA8)
PA9: P4.4 UM1.30(PA9/USART1_TX)
PA10: P4.6 UM1.31(PA10/USART1_RX)
PA11: P4.7 UM1.32(PA11)
PA12: CJ6.2 GP3.4(C) R4.1 UM1.33(PA12)
PA13: ST-LINK1.4 UM1.34(PA13__(SWDIO))
PA14: P4.10 ST-LINK1.5 UM1.37(PA14__(SWCLK))
PA15: P4.9 UM1.38(PA15/USART1_RX)
PB1: CJ2.2 GP1.4(C) R2.1 UM1.19(PB1)
PB2: CJ4.2 GP2.4(C) R3.1 UM1.20(PB2)
PB3: RH44.2 UM1.39(PB3/SPI1_SCK)
PB8: IIC1.6(SCL) RV2.1 UM1.45(PB8/I2C1_SCL)  [also labelled S_SCL]
PB9: IIC1.5(SDA) RV1.1 UM1.46(PB9/I2C1_SDA)  [also labelled S_SDA]
PB10: RH43.2 RU3.2 UM1.21(PB10/I2C2_SCL)
PB11: RH42.2 RU4.2 UM1.22(PB11/I2C1_SDA)
PB12: JP2.2 RD1.2 UM1.25(PB12)
PF7: RH4.2 UM1.36(PF7)
PT100-1: CX1.2 LX1.2 P0.1 PT2.1
PT100-2: CX2.2 LX2.2 P0.3 PT3.1
PT100-3: CX3.2 LX3.2 P0.5 PT4.1
PT100-4: CX4.2 LX4.2 P0.7 PT5.1
PT100-5: CX5.2 LX5.2 P0.9 PT6.1
PWRKEY: QK14.1(C) R5.2 UA1.12(WAKEUP_IN)
SCK: UA1.3(SPI_CLK/GPIO_15)
SD-INT2: UA1.27(UART2_RXD/GPIO_2)
SIM_CLK: C8.1 RA9.2 UA1.23(SIM_CLK) VR5.1
SIM_DAT: C9.1 RA8.1 UA1.22(SIM_DAT) VR2.1
SIM_RST: C10.1 RA7.1 UA1.20(SIM_RST) VR3.1
TCLCS1: HC2.2(QC) RH8.1
TCLCS2: HC2.3(QD) RH17.1
TCLCS3: HC2.4(QE) RH26.1
TCLCS4: HC2.5(QF) RH33.1
TCLCS5: HC2.6(QG) RH39.1
UART1_RXD/GPIO_0: TTL2.1 UA1.9(UART1_RXD/GPIO_13)
UART1_TXD/GPIO_1: TTL2.3 UA1.8(UART1_TXD/GPIO_12)
USART1_RX: TTL1.3 TTL2.4 UM1.43(PB7/I2C1_SDA/USART1_RX)
USART1_TX: TTL1.2 TTL2.2 UM1.42(PB6/I2C1_SCL/USART1_TX)
USART2_RX: U1.1(RO) UM1.13(PA3)
USART2_TX: U1.4(DI) UM1.12(PA2)
串1: HC1.15(QA) RH29.2
串2: HC1.1(QB) RH25.2
串3: HC1.2(QC) RH24.2
串4: HC1.3(QD) RH21.2
串5: HC1.4(QE) RH11.2
串6: HC1.5(QF) RH12.2
串7: HC1.6(QG) RH13.2
串8: HC1.7(QH) RH3.2
串9: HC2.15(QA) RH2.2
串10: HC2.1(QB) RH1.2
Net1_5: 1.5 Cu10.1 RH7.1
Net2_5: 2.5 Cu19.1 RH16.1
Net3_5: 3.5 Cu22.1 RH23.1
Net4_5: 4.5 Cu24.1 RH32.1
Net5_5: 5.5 Cu26.1 RH38.1
NetC1_2: C1.2 D1.2(K) RF1.2 RK1.2
NetC2_2: C2.2 D2.2(K) RF2.2 RK2.2
NetC3_2: C3.2 D3.2(K) RF3.2 RK3.2
NetC4_2: C4.2 D4.2(K) RF4.2 RK4.2
NetC5_2: C5.2 D5.2(K) RF5.2 RK5.2
NetCU11_1: CU11.1 UM1.5(PF0-OSC_IN) X1.1(OSC1)
NetCU12_1: CU12.1 UM1.6(PF1-OSC_OUT) X1.2(OSC2)
NetCY1_2: CY1.2 LX1.1 RE1.2 RQ1.1 RT1.2
NetCY2_2: CY2.2 LX2.1 RE3.2 RQ2.1 RT2.2
NetCY3_2: CY3.2 LX3.1 RE5.2 RQ3.1 RT3.2
NetCY4_2: CY4.2 LX4.1 RE7.2 RQ4.1 RT4.2
NetCY5_2: CY5.2 LX5.1 RE9.2 RQ5.1 RT5.2
NetD6_1: D6.1 R6.1
NetD7_1: D7.1 RR1.1
NetDE1_1: DE1.1(A) RG1.2
NetDE1_2: DE1.2(K) GP1.1(A)
NetDE2_1: DE2.1(A) RG2.2
NetDE2_2: DE2.2(K) GP2.1(A)
NetDE3_1: DE3.1(A) RG3.2
NetDE3_2: DE3.2(K) GP3.1(A)
NetDJ1_1: DJ1.1(A) DL3.2(K) K1.5 QK1.1(C)
NetDJ2_1: DJ2.1(A) DL4.2(K) K2.5 QK2.1(C)
NetDJ3_1: DJ3.1(A) DL5.2(K) K3.5 QK3.1(C)
NetDJ4_1: DJ4.1(A) DL7.2(K) K4.5 QK5.1(C)
NetDJ5_1: DJ5.1(A) DL8.2(K) K5.5 QK6.1(C)
NetDJ6_1: DJ6.1(A) DL9.2(K) K6.5 QK7.1(C)
NetDJ7_1: DJ7.1(A) DL12.2(K) K7.5 QK8.1(C)
NetDJ8_1: DJ8.1(A) DL13.2(K) K8.5 QK9.1(C)
NetDJ9_1: DJ9.1(A) DL14.2(K) K9.5 QK10.1(C)
NetDJ10_1: DJ10.1(A) DL16.2(K) K10.5 QK11.1(C)
NetDL1_1: DL1.1(A) RJ4.2
NetDL2_1: DL2.1(A) RJ5.2
NetDL3_1: DL3.1(A) RJ1.2
NetDL4_1: DL4.1(A) RJ2.2
NetDL5_1: DL5.1(A) RJ3.2
NetDL6_1: DL6.1(A) RJ7.2
NetDL7_1: DL7.1(A) RJ8.2
NetDL8_1: DL8.1(A) RJ9.2
NetDL9_1: DL9.1(A) RJ10.2
NetDL10_1: DL10.1(A) RJ11.2
NetDL11_1: DL11.1(A) RJ15.2
NetDL12_1: DL12.1(A) RJ12.2
NetDL13_1: DL13.1(A) RJ13.2
NetDL14_1: DL14.1(A) RJ14.2
NetDL15_1: DL15.1(A) RJ17.2
NetDL16_1: DL16.1(A) RJ16.2
NetDL17_1: DL17.1(A) RJ18.2
NetDL18_1: DL18.1(A) RJ19.2
NetHC1_9: HC1.9(SQH) HC2.14(SER)
NetJ1_5: J1.5(RST) RA7.2
NetJ1_6: J1.6(I/O) RA6.1 RA8.2
NetJ1_7: J1.7(CLK) RA9.1
NetLS1_1: LS1.1 RJ6.2
NetLS1_2: LS1.2 QK4.1(C)
NetQK1_2: QK1.2(B) RH1.1 RI1.1
NetQK2_2: QK2.2(B) RH2.1 RI2.1
NetQK3_2: QK3.2(B) RH3.1 RI3.1
NetQK4_2: QK4.2(B) RH4.1 RI4.1
NetQK5_2: QK5.2(B) RH11.1 RI5.1
NetQK6_2: QK6.2(B) RH12.1 RI6.1
NetQK7_2: QK7.2(B) RH13.1 RI7.1
NetQK8_2: QK8.2(B) RH21.1 RI8.1
NetQK9_2: QK9.2(B) RH24.1 RI9.1
NetQK10_2: QK10.2(B) RH25.1 RI10.1
NetQK11_2: QK11.2(B) RH29.1 RI11.1
NetQK12_2: QK12.2(B) RH42.1 RI12.1
NetQK13_1: QK13.1(C) S1.1 UA1.1(GPIO1) VR1.1
NetQK13_2: QK13.2(B) RH43.1 RI13.1
NetQK14_2: QK14.2(B) RH44.1 RI14.1
NetRA1_1: RA1.1 RF1.1 U6.1(OUT)
NetRA1_2: RA1.2 RY1.1 U6.2(IN-)
NetRA2_1: RA2.1 RF2.1 U6.7(OUT)
NetRA2_2: RA2.2 RY2.1 U6.6(IN-)
NetRA3_1: RA3.1 RF3.1 U7.1(OUT)
NetRA3_2: RA3.2 RY3.1 U7.2(IN-)
NetRA4_1: RA4.1 RF4.1 U7.7(OUT)
NetRA4_2: RA4.2 RY4.1 U7.6(IN-)
NetRA5_1: RA5.1 RF5.1 U9.1(OUT)
NetRA5_2: RA5.2 RY5.1 U9.2(IN-)
NetRE2_2: RE2.2 RW1.1 RY1.2
NetRE4_2: RE4.2 RW2.1 RY2.2
NetRE6_2: RE6.2 RW3.1 RY3.2
NetRE8_2: RE8.2 RW4.1 RY4.2
NetRE10_2: RE10.2 RW5.1 RY5.2
NetRH5_2: RH5.2 TCL1.1(DIN)
NetRH6_2: RH6.2 TCL1.2(SCLK)
NetRH7_2: RH7.2 RJ7.1 TCL1.7(OUT)
NetRH8_2: RH8.2 TCL1.3(CS)
NetRH9_2: RH9.2 TCL1.6(REFIN)
NetRH10_2: RH10.2 TCL1.4(DOUT)
NetRH14_2: RH14.2 TCL2.1(DIN)
NetRH15_2: RH15.2 TCL2.2(SCLK)
NetRH16_2: RH16.2 RJ11.1 TCL2.7(OUT)
NetRH17_2: RH17.2 TCL2.3(CS)
NetRH18_2: RH18.2 TCL2.6(REFIN)
NetRH19_2: RH19.2 TCL2.4(DOUT)
NetRH20_2: RH20.2 TCL3.1(DIN)
NetRH22_2: RH22.2 TCL3.2(SCLK)
NetRH23_2: RH23.2 RJ15.1 TCL3.7(OUT)
NetRH26_2: RH26.2 TCL3.3(CS)
NetRH27_2: RH27.2 TCL3.6(REFIN)
NetRH28_2: RH28.2 TCL3.4(DOUT)
NetRH30_2: RH30.2 TCL4.1(DIN)
NetRH31_2: RH31.2 TCL4.2(SCLK)
NetRH32_2: RH32.2 RJ17.1 TCL4.7(OUT)
NetRH33_2: RH33.2 TCL4.3(CS)
NetRH34_2: RH34.2 TCL4.6(REFIN)
NetRH35_2: RH35.2 TCL4.4(DOUT)
NetRH36_2: RH36.2 TCL5.1(DIN)
NetRH37_2: RH37.2 TCL5.2(SCLK)
NetRH38_2: RH38.2 RJ18.1 TCL5.7(OUT)
NetRH39_2: RH39.2 TCL5.3(CS)
NetRH40_2: RH40.2 TCL5.6(REFIN)
NetRH41_2: RH41.2 TCL5.4(DOUT)
NetRN1_1: RN1.1 RT1.1 U6.3(IN+)
NetRN2_1: RN2.1 RT2.1 U6.5(IN+)
NetRN3_1: RN3.1 RT3.1 U7.3(IN+)
NetRN4_1: RN4.1 RT4.1 U7.5(IN+)
NetRN5_1: RN5.1 RT5.1 U9.3(IN+)
NetTTL1_1: TTL1.1 TTL-SW1.2

Not connected (* = marked no-connect by the designer): HC2 9(SQH); J1 1(CD)* 4(VPP)*; JP2 3; K1 2; K2 2; K3 2; K4 2; K5 2; K6 2; K7 2; K8 2; K9 2; K10 2; UA1 16(AON_GPIO_3) 17(AON_GPIO_2)

### Notes on the sheet
- 220V转12V
- 电源
- 12V to 3.3V
- RS485
- 风机
- 机房风扇
- 铁芯报警
- 蜂鸣器
- 主控芯片
- 程序下载口
- 超温跳闸
- 万能输出
- 超温报警
- (near RA1) 5路PT100测温
- 故障报警
- 温湿度控制
- 备用测温
- 10路继电器
- (near W1) 网口模块
- (near J1) MICRO-SIM
- Labels drawn without touching a wire or pin: 4-20mA, A相信号输入, B相信号输入, C相信号输入, NB-IOT, 减键, 加键, 备用IO, 数据存储芯片, 数码管, 数码管驱动IC, 消音+返回, 温湿度传感器, 物联网, 设置

### Library data of the parts
1-5 = Header 3X2A: Header, 3-Pin, Dual row
C1-C5 Cu1-Cu10 Cu15 Cu19 Cu21-Cu30 CX1-CX5 CY1-CY5 = Cap: Capacitor
  Cu1: Published: 8-Jun-2000; LatestRevisionDate: 17-Jul-2002; LatestRevisionNote: Re-released for DXP Platform.; Publisher: Altium Limited
C6-C10 = CAP NP_Dup4
CD1 = CAP-18PF-0402-C0G: CAP CER C0G;18PF;+/-5%;50V;0402;0.5mm;ROHS
CD2 = CAP-33PF-0402-C0G: CAP CER C0G;33PF;+/-5%;50V;0402;0.5mm;ROHS
CD3 = CAP-0.1UF-0402-X7R: CAP CER X7R;0.1uF;+/-10%;16V;0402;0.5mm;ROHS
CD4 = CAP-AL-1000UF-10.4X10.4: Value: 1000uF
CJ1-CJ6 CK1 CP1-CP12 CS1 = 104: Capacitor
  CJ1-CJ6 CK1: Published: 8-Jun-2000; LatestRevisionDate: 17-Jul-2002; LatestRevisionNote: Re-released for DXP Platform.; PackageReference: RAD-0.3; Publisher: Altium Limited; Value: 104
CU11 CU12 CU17 = CAP: Capacitor; Fitted: NO
CU13 CU14 CU16 CU18 CU20 = Cap: Capacitor; Value: 0.01uF; Published: 8-Jun-2000; LatestRevisionDate: 17-Jul-2002; LatestRevisionNote: Re-released for DXP Platform.; PackageReference: RAD-0.3; Publisher: Altium Limited
D1-D5 = D Zener: Zener Diode
D6 D7 = DIODE-LED-BLUE-0603: LED;Blue;3V;LED-0603;0.5mm;ROHS; Manufacture 1 P/N: 19-217/BHC-ZL1M2RY/3T;BL-HB336G-TRB;HT-195NB5;; Manufacture 1: Everlight;佰鸿;Harvatek;; Serial Number: 81230000004; Geometry.Height: 0.5mm; PCB DECAL: LED-0603
DE1-DE3 DL1-DL18 = LED1: Typical RED GaAs LED; Published: 8-Jun-2000; LatestRevisionDate: 08-Jul-2005; LatestRevisionNote: Mech Layer 1 removed.; PackageReference: LED-1; Publisher: Altium Limited
DJ1-DJ10 = DIODE
DP1-DP3 DZ1 = D
FD1 = Fuse 1: Fuse
JP1 NB-SW1 TTL-SW1 = Header 3: Header, 3-Pin; LatestRevisionDate: 17-Jul-2002; LatestRevisionNote: Re-released for DXP Platform.; Publisher: Altium Limited
JP2 PJP1 TTL1 = Header 4: Header, 4-Pin
  JP2 TTL1: LatestRevisionDate: 17-Jul-2002; LatestRevisionNote: Re-released for DXP Platform.; Publisher: Altium Limited
JP3 = Header 6: Header, 6-Pin; LatestRevisionDate: 17-Jul-2002; LatestRevisionNote: Re-released for DXP Platform.; Publisher: Altium Limited
JP3-1 KEY1-KEY3 P1 PT2-PT6 SMA1 = Header 2: Header, 2-Pin
  KEY1-KEY3 PT2-PT6 SMA1: LatestRevisionDate: 17-Jul-2002; LatestRevisionNote: Re-released for DXP Platform.; Publisher: Altium Limited
JP4 P0 P4 = Header 10: Header, 10-Pin
  JP4 P0: LatestRevisionDate: 17-Jul-2002; LatestRevisionNote: Re-released for DXP Platform.; Publisher: Altium Limited
K1-K10 = RELAY-SPDT
LS1 = Speaker: Loudspeaker
LX1-LX5 = L
MK1 = Header 2X2: Header, 2-Pin, Dual row; LatestRevisionDate: 17-Jul-2002; LatestRevisionNote: Re-released for DXP Platform.; Publisher: Altium Limited
P2 P3 = Header 12: Header, 12-Pin
QK1-QK14 = NPN: NPN Bipolar Transistor; Published: 8-Jun-2000; LatestRevisionDate: 17-Jul-2002; LatestRevisionNote: Re-released for DXP Platform.; PackageReference: TO-226; Publisher: Altium Limited; Code_JEDEC: TO-226-AA
R1 = R1005_0
R2-R4 = Res2: Resistor; Value: 4.7k; Published: 8-Jun-2000; LatestRevisionDate: 17-Jul-2002; LatestRevisionNote: Re-released for DXP Platform.; PackageReference: AXIAL-0.4; Publisher: Altium Limited
R5 = RES-10K-0402: RES FILM;10K;+/-5%;1/16W;0402;0.4mm;ROHS
R6 = RES-510-0402
RA1-RA5 RE1-RE10 RF1-RF5 RK1-RK5 RL1-RL5 RN1-RN5 RO1-RO6 RQ1-RQ5 RT1-RT5 RU1-RU4 RW1-RW5 RY1-RY5 YM1 = Res2: Resistor
  RU1 RU4: Published: 8-Jun-2000; LatestRevisionDate: 17-Jul-2002; LatestRevisionNote: Re-released for DXP Platform.; Publisher: Altium Limited
RA6 = R
RA7-RA9 = R_Dup2
RD1 RV1 RV2 RZ1-RZ3 = Res2: Resistor; Value: 1K; Published: 8-Jun-2000; LatestRevisionDate: 17-Jul-2002; LatestRevisionNote: Re-released for DXP Platform.; PackageReference: AXIAL-0.4; Publisher: Altium Limited
RG1-RG3 = Res1: Resistor
RH1-RH44 RI1-RI14 RJ1-RJ19 = RES2
RR1 = RES-1K-0402: RES FILM;1K;+/-5%;1/16W;0402;0.4mm;ROHS
S1 = SW-PB: Switch; Published: 24-Mar-1999; LatestRevisionDate: 17-Jul-2002; LatestRevisionNote: Re-released for DXP Platform.; PackageReference: SPST-2; Publisher: Altium Limited
ST-LINK1 = Header 5: Header, 5-Pin; LatestRevisionDate: 17-Jul-2002; LatestRevisionNote: Re-released for DXP Platform.; Publisher: Altium Limited
TTL2 = Header 3X2: Header, 3-Pin, Dual row; LatestRevisionDate: 17-Jul-2002; LatestRevisionNote: Re-released for DXP Platform.; Publisher: Altium Limited
TVS1 TVS2 = Diode 10TQ035: Schottky Rectifier; Published: *; LatestRevisionDate: *; LatestRevisionNote: *; DatasheetDocument: *; PackageDocument: *; PackageReference: *; Publisher: *; ComponentLink1Description: *; ComponentLink1URL: *; Note: *
U2 = 1117-3.3: 800mA and 1A Low Dropout Positive Regulator 2.85V, 3.3V, 5V, and Adjustable; PackageDocument: revC; Published: 8-Jun-2000; LatestRevisionDate: 17-Jul-2002; LatestRevisionNote: Re-released for DXP Platform.; DatasheetDocument: Sep-1997; PackageReference: ZZ311; Publisher: Altium Limited
U3-U5 U8 U10 = 1117-3.3: 800mA and 1A Low Dropout Positive Regulator 2.85V, 3.3V, 5V, and Adjustable
U6 U7 U9 = LM258N: Dual Low-Power Operational Amplifier
VR1-VR5 = ESD-TVS-UM5079: TVS;7V;65pf;SOD882;ROHS; Manufacture 1: Union;韦尔;; Manufacture 1 P/N: ESD9X7V-2/TR;UM5079; Serial Number: 81121000008; Geometry.Height: 0.55mm; PCB DECAL: ESD-TVS-UM5079
X1 = XTAL: Crystal Oscillator; Fitted: NO; Published: 8-Jun-2000; LatestRevisionDate: 17-Jul-2002; LatestRevisionNote: Re-released for DXP Platform.; PackageReference: R38; Publisher: Altium Limited